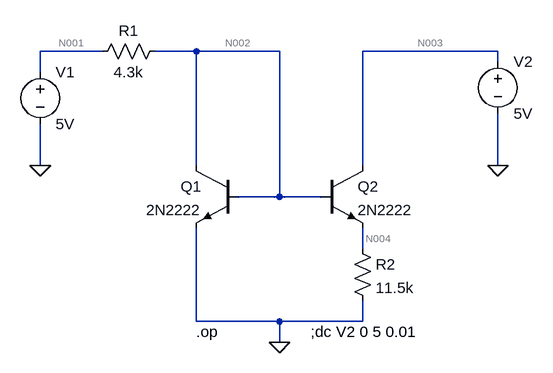
[diagram p0: schematic widlar.asc]
widlar.asc, the LTspice schematic file:
Version 4
SHEET 1 1128 680
WIRE 272 96 176 96
WIRE 416 96 352 96
WIRE 544 96 416 96
WIRE 880 96 672 96
WIRE 880 112 880 96
WIRE 176 128 176 96
WIRE 176 272 176 208
WIRE 416 272 416 96
WIRE 672 272 672 96
WIRE 880 272 880 192
WIRE 544 320 544 96
WIRE 544 320 480 320
WIRE 608 320 544 320
WIRE 672 400 672 368
WIRE 416 512 416 368
WIRE 544 512 416 512
WIRE 672 512 672 480
WIRE 672 512 544 512
WIRE 544 544 544 512
FLAG 176 272 0
FLAG 880 272 0
FLAG 544 544 0
SYMBOL voltage 176 112 R0
WINDOW 123 0 0 Left 0
WINDOW 39 0 0 Left 0
SYMATTR InstName V1
SYMATTR Value 5V
SYMBOL voltage 880 96 R0
SYMATTR InstName V2
SYMATTR Value 5V
SYMBOL npn 480 272 M0
SYMATTR InstName Q1
SYMATTR Value 2N2222
SYMBOL npn 608 272 R0
SYMATTR InstName Q2
SYMATTR Value 2N2222
SYMBOL res 368 80 R90
WINDOW 0 0 56 VBottom 2
WINDOW 3 32 56 VTop 2
SYMATTR InstName R1
SYMATTR Value 4.3k
SYMBOL res 656 384 R0
SYMATTR InstName R2
SYMATTR Value 11.5k
TEXT 416 528 Left 2 !.op
TEXT 592 528 Left 2 !;dc V2 0 5 0.01

The netlist it stands for:
* widlar.asc
V1 N001 0 5V
V2 N003 0 5V
Q1 N002 N002 0 0 2N2222
Q2 N003 N002 N004 0 2N2222
R1 N002 N001 4.3k
R2 N004 0 11.5k
.model NPN NPN
.model PNP PNP
.lib standard.bjt
.op
;dc V2 0 5 0.01
.backanno
.end

* Results of the author's LTspice run, read from the files saved beside the schematic
* Operating Point:
*   V(n001) = 5 V
*   V(n003) = 5 V
*   V(n002) = 655.6 mV
*   V(n004) = 119.8 mV
*   Ic(Q2) = 10.36 µA
*   Ib(Q2) = 49.66 nA
*   Ie(Q2) = -10.41 µA
*   Ic(Q1) = 1.005 mA
*   Ib(Q1) = 5.043 µA
*   Ie(Q1) = -1.01 mA
*   I(R2) = 10.41 µA
*   I(R1) = -1.01 mA
*   I(V2) = -10.36 µA
*   I(V1) = -1.01 mA